# Altium schematic sheet Motors.SchDoc
size A4; SheetNumber: 6; SheetTotal: 6
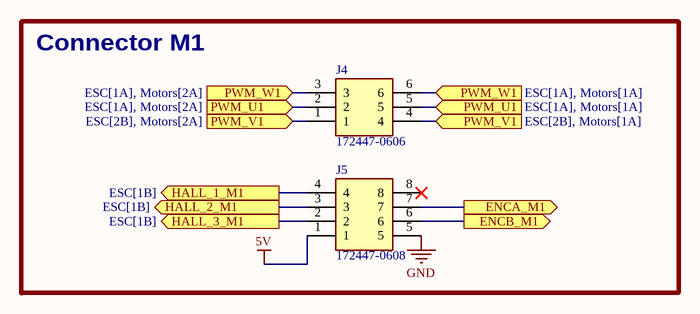
[diagram p0: Motors.SchDoc]

## Parts
J4  172447-0606  [172447-YY06]
J5  172447-0608  [172447-YY08]

## Blocks framed on the sheet
Connector M1: J4 J5

## Ports
ENCA_M1 (out), ENCB_M1 (out), HALL_1_M1 (out, see ESC[1B]), HALL_2_M1 (out, see ESC[1B]), HALL_3_M1 (out, see ESC[1B]), PWM_U1 (in, see ESC[1A], Motors[1A]), PWM_U1 (in, see ESC[1A], Motors[2A]), PWM_V1 (in, see ESC[2B], Motors[1A]), PWM_V1 (in, see ESC[2B], Motors[2A]), PWM_W1 (in, see ESC[1A], Motors[1A]), PWM_W1 (in, see ESC[1A], Motors[2A])

## Nets
5V: J5.1
GND: J5.5
ENCA_M1: J5.7 ; port ENCA_M1
ENCB_M1: J5.6 ; port ENCB_M1
HALL_1_M1: J5.4 ; port HALL_1_M1
HALL_2_M1: J5.3 ; port HALL_2_M1
HALL_3_M1: J5.2 ; port HALL_3_M1
PWM_U1: J4.2 J4.5 ; port PWM_U1
PWM_V1: J4.1 J4.4 ; port PWM_V1
PWM_W1: J4.3 J4.6 ; port PWM_W1

Not connected (* = marked no-connect by the designer): J5 8*

## Library data of the parts
J4 = 172447-0606: Connector; Manufacturer_Name: Molex; Datasheet Link: https://www.molex.com/pdm_docs/sd/1724470406_sd.pdf; Height: 12.8mm; Manufacturer_Part_Number: 172447-0606; Mouser Part Number: 538-172447-0606; Mouser Price/Stock: https://www.mouser.co.uk/ProductDetail/Molex/172447-0606?qs=t7xnP681wgUnuNdnB4N%252Bbw%3D%3D
J5 = 172447-0608: Connector Mate 46992-0840; Manufacturer_Name: Molex; Datasheet Link: https://www.molex.com/pdm_docs/sd/1724470406_sd.pdf; Height: 12.8mm; Manufacturer_Part_Number: 172447-0608; Mouser Part Number: 538-172447-0608; Mouser Price/Stock: https://www.mouser.co.uk/ProductDetail/Molex/172447-0608?qs=t7xnP681wgUaroQMnMhOkA%3D%3D